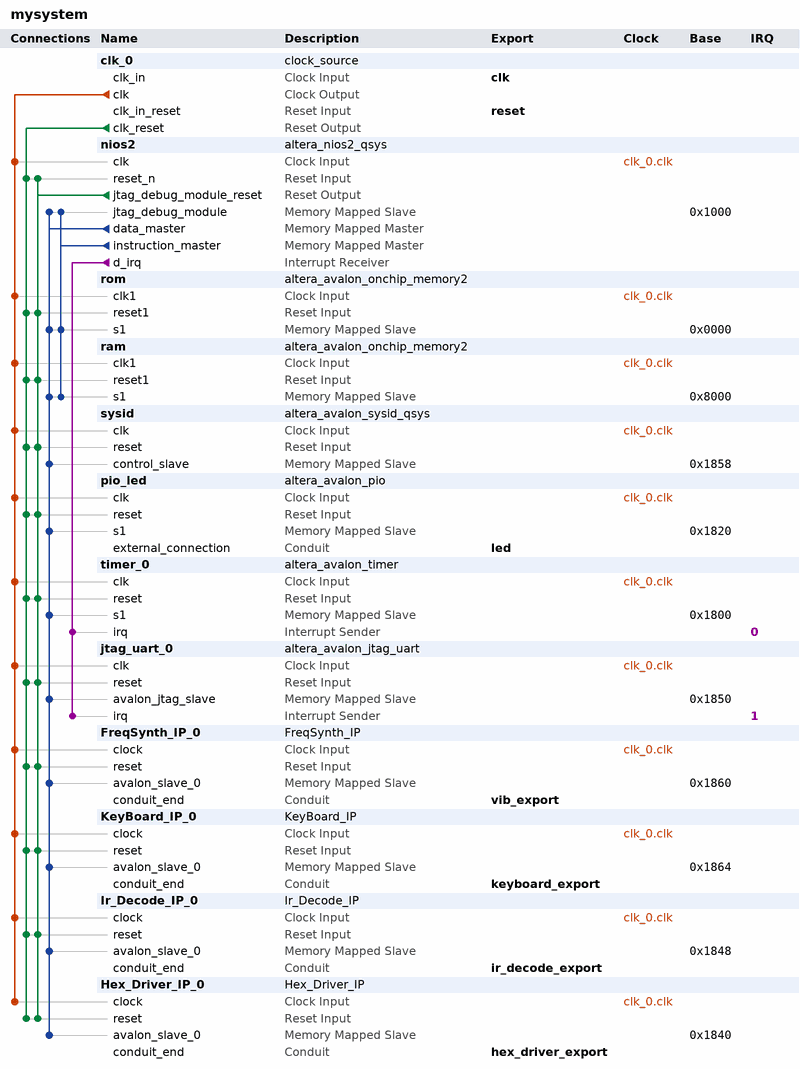
[diagram p0: system contents]
# Platform Designer (Qsys) system mysystem, Cyclone IV E EP4CE6F17C8
# Parameters at their usual value, and those the tool derives, are not listed.
package require -exact qsys 13.1
create_system mysystem
set_project_property DEVICE_FAMILY {Cyclone IV E}
set_project_property DEVICE EP4CE6F17C8

add_instance clk_0 clock_source 13.1
set_instance_parameter_value clk_0 clockFrequency 50000000

add_instance nios2 altera_nios2_qsys 13.1
set_instance_parameter_value nios2 resetSlave rom.s1
set_instance_parameter_value nios2 mmu_TLBMissExcSlave None
set_instance_parameter_value nios2 exceptionSlave ram.s1
set_instance_parameter_value nios2 breakSlave nios2.jtag_debug_module
set_instance_parameter_value nios2 impl Fast
set_instance_parameter_value nios2 icache_size 4096

add_instance rom altera_avalon_onchip_memory2 13.1
set_instance_parameter_value rom dataWidth 32
set_instance_parameter_value rom dualPort false
set_instance_parameter_value rom initMemContent true
set_instance_parameter_value rom initializationFileName onchip_mem.hex
set_instance_parameter_value rom memorySize 2048
set_instance_parameter_value rom writable false

add_instance ram altera_avalon_onchip_memory2 13.1
set_instance_parameter_value ram dataWidth 32
set_instance_parameter_value ram dualPort false
set_instance_parameter_value ram initMemContent true
set_instance_parameter_value ram initializationFileName onchip_mem.hex
set_instance_parameter_value ram memorySize 13000

add_instance sysid altera_avalon_sysid_qsys 13.1
set_instance_parameter_value sysid id -2023406815

add_instance pio_led altera_avalon_pio 13.1
set_instance_parameter_value pio_led bitModifyingOutReg true
set_instance_parameter_value pio_led direction Output
set_instance_parameter_value pio_led resetValue 15
set_instance_parameter_value pio_led width 8

add_instance timer_0 altera_avalon_timer 13.1
set_instance_parameter_value timer_0 period 1
set_instance_parameter_value timer_0 periodUnits MSEC

add_instance jtag_uart_0 altera_avalon_jtag_uart 13.1
set_instance_parameter_value jtag_uart_0 simInteractiveOptions NO_INTERACTIVE_WINDOWS

add_instance FreqSynth_IP_0 FreqSynth_IP 1.0

add_instance KeyBoard_IP_0 KeyBoard_IP 1.0

add_instance Ir_Decode_IP_0 Ir_Decode_IP 1.0

add_instance Hex_Driver_IP_0 Hex_Driver_IP 1.0

# connections
add_connection clk_0.clk FreqSynth_IP_0.clock clock
add_connection clk_0.clk Hex_Driver_IP_0.clock clock
add_connection clk_0.clk Ir_Decode_IP_0.clock clock
add_connection clk_0.clk jtag_uart_0.clk clock
add_connection clk_0.clk KeyBoard_IP_0.clock clock
add_connection clk_0.clk nios2.clk clock
add_connection clk_0.clk pio_led.clk clock
add_connection clk_0.clk ram.clk1 clock
add_connection clk_0.clk rom.clk1 clock
add_connection clk_0.clk sysid.clk clock
add_connection clk_0.clk timer_0.clk clock
add_connection clk_0.clk_reset FreqSynth_IP_0.reset reset
add_connection clk_0.clk_reset Hex_Driver_IP_0.reset reset
add_connection clk_0.clk_reset Ir_Decode_IP_0.reset reset
add_connection clk_0.clk_reset jtag_uart_0.reset reset
add_connection clk_0.clk_reset KeyBoard_IP_0.reset reset
add_connection clk_0.clk_reset nios2.reset_n reset
add_connection clk_0.clk_reset pio_led.reset reset
add_connection clk_0.clk_reset ram.reset1 reset
add_connection clk_0.clk_reset rom.reset1 reset
add_connection clk_0.clk_reset sysid.reset reset
add_connection clk_0.clk_reset timer_0.reset reset
add_connection nios2.jtag_debug_module_reset FreqSynth_IP_0.reset reset
add_connection nios2.jtag_debug_module_reset Hex_Driver_IP_0.reset reset
add_connection nios2.jtag_debug_module_reset Ir_Decode_IP_0.reset reset
add_connection nios2.jtag_debug_module_reset jtag_uart_0.reset reset
add_connection nios2.jtag_debug_module_reset KeyBoard_IP_0.reset reset
add_connection nios2.jtag_debug_module_reset nios2.reset_n reset
add_connection nios2.jtag_debug_module_reset pio_led.reset reset
add_connection nios2.jtag_debug_module_reset ram.reset1 reset
add_connection nios2.jtag_debug_module_reset rom.reset1 reset
add_connection nios2.jtag_debug_module_reset sysid.reset reset
add_connection nios2.jtag_debug_module_reset timer_0.reset reset
add_connection nios2.data_master FreqSynth_IP_0.avalon_slave_0 avalon
set_connection_parameter_value nios2.data_master/FreqSynth_IP_0.avalon_slave_0 baseAddress 0x1860
add_connection nios2.data_master Hex_Driver_IP_0.avalon_slave_0 avalon
set_connection_parameter_value nios2.data_master/Hex_Driver_IP_0.avalon_slave_0 baseAddress 0x1840
add_connection nios2.data_master Ir_Decode_IP_0.avalon_slave_0 avalon
set_connection_parameter_value nios2.data_master/Ir_Decode_IP_0.avalon_slave_0 baseAddress 0x1848
add_connection nios2.data_master jtag_uart_0.avalon_jtag_slave avalon
set_connection_parameter_value nios2.data_master/jtag_uart_0.avalon_jtag_slave baseAddress 0x1850
add_connection nios2.data_master KeyBoard_IP_0.avalon_slave_0 avalon
set_connection_parameter_value nios2.data_master/KeyBoard_IP_0.avalon_slave_0 baseAddress 0x1864
add_connection nios2.data_master nios2.jtag_debug_module avalon
set_connection_parameter_value nios2.data_master/nios2.jtag_debug_module baseAddress 0x1000
add_connection nios2.data_master pio_led.s1 avalon
set_connection_parameter_value nios2.data_master/pio_led.s1 baseAddress 0x1820
add_connection nios2.data_master ram.s1 avalon
set_connection_parameter_value nios2.data_master/ram.s1 baseAddress 0x8000
add_connection nios2.data_master rom.s1 avalon
set_connection_parameter_value nios2.data_master/rom.s1 baseAddress 0x0000
add_connection nios2.data_master sysid.control_slave avalon
set_connection_parameter_value nios2.data_master/sysid.control_slave baseAddress 0x1858
add_connection nios2.data_master timer_0.s1 avalon
set_connection_parameter_value nios2.data_master/timer_0.s1 baseAddress 0x1800
add_connection nios2.instruction_master nios2.jtag_debug_module avalon
set_connection_parameter_value nios2.instruction_master/nios2.jtag_debug_module baseAddress 0x1000
add_connection nios2.instruction_master ram.s1 avalon
set_connection_parameter_value nios2.instruction_master/ram.s1 baseAddress 0x8000
add_connection nios2.instruction_master rom.s1 avalon
set_connection_parameter_value nios2.instruction_master/rom.s1 baseAddress 0x0000
add_connection nios2.d_irq jtag_uart_0.irq interrupt
set_connection_parameter_value nios2.d_irq/jtag_uart_0.irq irqNumber 1
add_connection nios2.d_irq timer_0.irq interrupt
set_connection_parameter_value nios2.d_irq/timer_0.irq irqNumber 0

# exported interfaces
add_interface clk clock sink
set_interface_property clk EXPORT_OF clk_0.clk_in
add_interface reset reset sink
set_interface_property reset EXPORT_OF clk_0.clk_in_reset
add_interface led conduit end
set_interface_property led EXPORT_OF pio_led.external_connection
add_interface vib_export conduit end
set_interface_property vib_export EXPORT_OF FreqSynth_IP_0.conduit_end
add_interface keyboard_export conduit end
set_interface_property keyboard_export EXPORT_OF KeyBoard_IP_0.conduit_end
add_interface ir_decode_export conduit end
set_interface_property ir_decode_export EXPORT_OF Ir_Decode_IP_0.conduit_end
add_interface hex_driver_export conduit end
set_interface_property hex_driver_export EXPORT_OF Hex_Driver_IP_0.conduit_end

set_interconnect_requirement {$system} qsys_mm.clockCrossingAdapter HANDSHAKE
set_interconnect_requirement {$system} qsys_mm.maxAdditionalLatency 1
set_interconnect_requirement {$system} qsys_mm.insertDefaultSlave false

save_system mysystem.qsys
